# Altium schematic sheet [07] - OTHER.SchDoc
size A3; DocumentNumber: 8; SheetNumber: 7; SheetTotal: 10
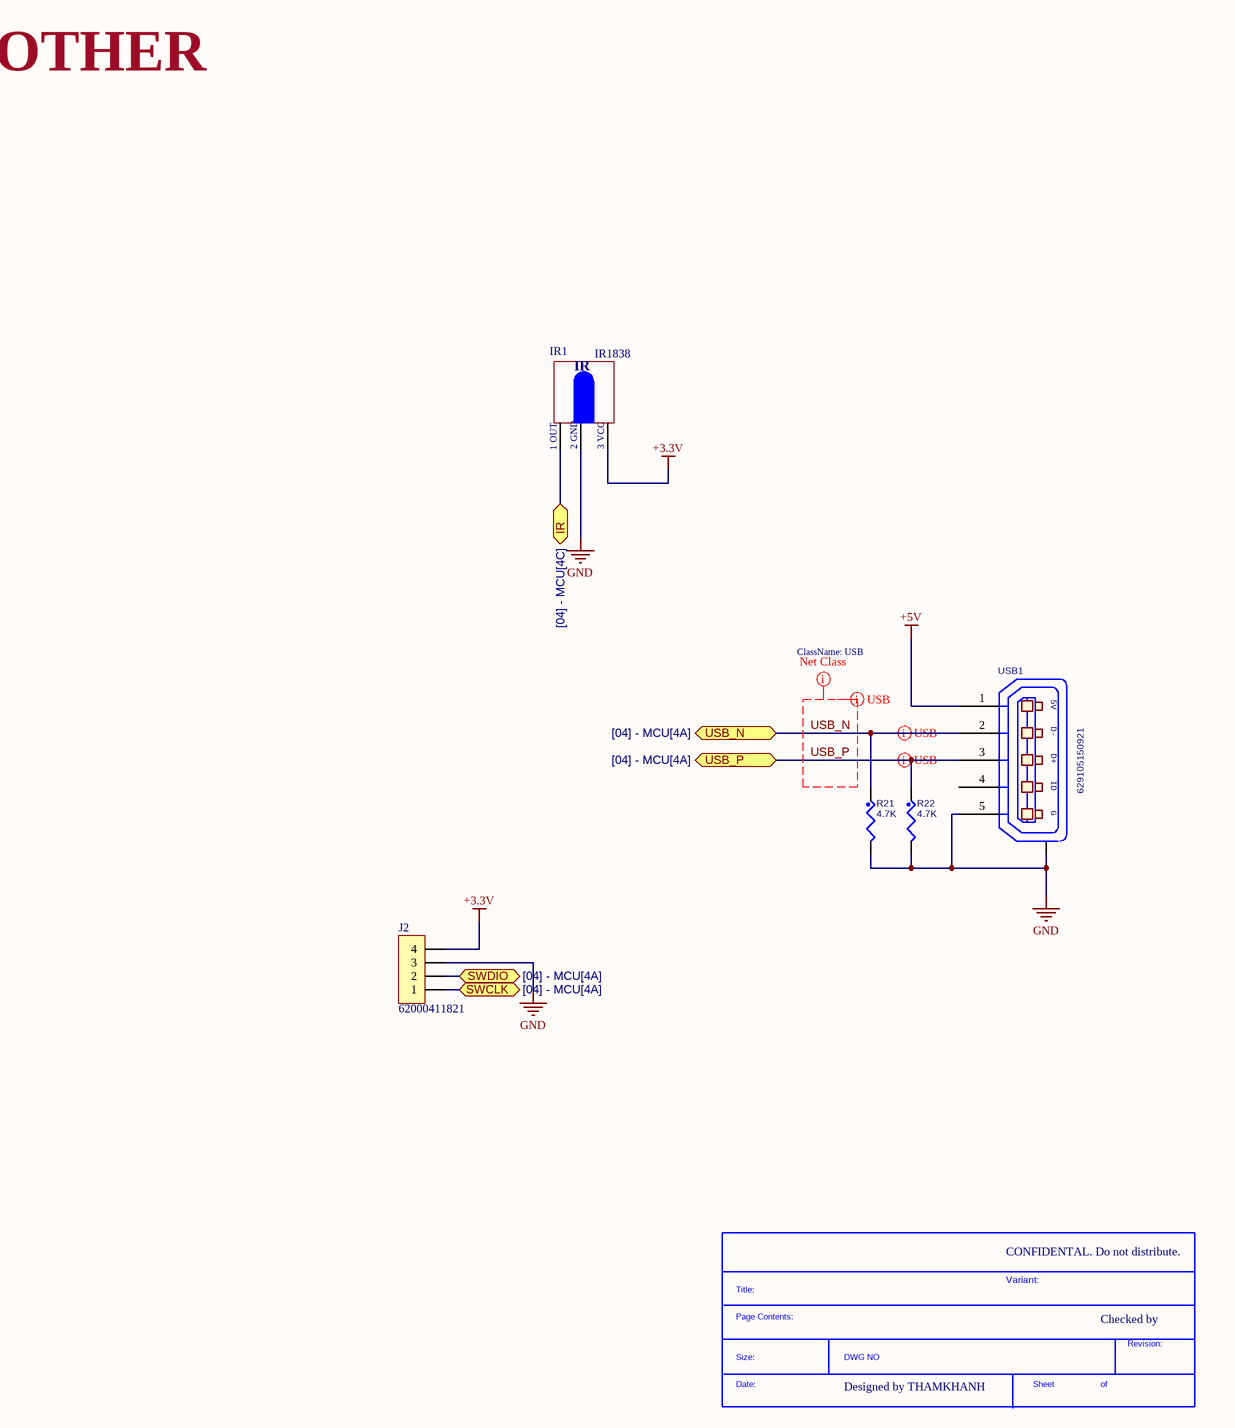
[diagram p0: [07] - OTHER.SchDoc]

## Parts
*?  SDTitleBlock  (value not drawn)  (graphical)
IR1  IR1838  [IR RECEIVE V1]
J2  62000411821  [62000411121]
R21  4.7K  [R0603]
R22  4.7K  [R0603]
USB1  629105150921  [USB-629105150921]

## Ports
IR (bidir, see [04] - MCU[4C]), SWCLK (bidir, see [04] - MCU[4A]), SWDIO (bidir, see [04] - MCU[4A]), USB_N (bidir, see [04] - MCU[4A]), USB_P (bidir, see [04] - MCU[4A])

## Nets
+3.3V: IR1.3(VCC) J2.4
+5V: USB1.1(P1)
GND: IR1.2(GND) J2.3 R21.2 R22.2 USB1.0(GND) USB1.5(P5)
IR: IR1.1(Out) ; port IR
SWCLK: J2.1 ; port SWCLK
SWDIO: J2.2 ; port SWDIO
USB_N: R21.1 USB1.2(P2) ; port USB_N
USB_P: R22.1 USB1.3(P3) ; port USB_P

Not connected (* = marked no-connect by the designer): USB1 4(P4)

## Layout directives
differential pair: USB_N, USB_P
net class USB: USB_N, USB_P

## Notes on the sheet
- OTHER
- CONFIDENTAL. Do not distribute.
- Variant:
- Checked by
- Designed by THAMKHANH
- (in symbol IR1838) IR; 1 OUT; 2 GND; 3 VCC
- (in symbol SDTitleBlock) Title:; Page Contents:; Revision:; Size:; DWG NO; Date:; Sheet; of
- (in symbol USB 2.0 Micro Type AB Female) 5V; D-; D+; ID; G

## Library data of the parts
IR1 = IR1838: VISHAY SEMICONDUCTOR   TSOP31238   IR RECEIVER, 40M, 38KHZ, SIP
J2 = JP4 2.00MM Single Socket: WR-PHD 2.00 mm Socket Header; Manufacturer: W¨¹rth Elektronik eiSos GmbH; ComponentLink1 Description: Manufacturer; ComponentLink2 Description: Datasheet; NoPins: 04; Created Date: 2 April 2013; partNo: 62000411821; ComponentLink1URL: http://www.we-online.com; ComponentLink2URL: http://katalog.we-online.de/em/datasheet/6200xx11821.pdf; Created by: Karrer Zheng
R21 R22 = RES-SMD: RES 0R OHM 1/8W 1% SMD; Manufacturer: Yageo; Manufacturer Part Number: RC0402FR-0749R9L; Power (Watts): 0.063W, 1/16W; .Checked PCB: used; Temperature Coefficient: ±100ppm/°C; Resistance: 3.3kR; Power Rating: 125mW; Voltage Rating: 100V; Category: Resistors; Supplier Part Number: 311-49.9LRCT-ND; Package / Case: 0402 (1005 Metric); Price 1k [$]: 0.01421; Tolerance: ±1%; Value: 0R; .Checked SCH: used; Supplier: Digikey; RoHS: RoHS Compliant; Composition: Thick Film; Features: -; Size / Dimension: 0.039" L x 0.020" W (1.00mm x 0.50mm); Height: 0.016" (0.40mm); Number of Terminations: 2; Packaging: Cut Tape (CT); ComponentLink1URL: http://www.yageo.com/documents/recent/PYu-RC0402_51_RoHS_L_6.pdf; ComponentLink1Description: http://www.yageo.com/documents/recent/PYu-RC0402_51_RoHS_L_6.pdf; Resistance (Ohms): 0R; Mount: Surface Mount; Case/Package: 0805; Number of Pins: 2; Contact Plating: Tin; Case Code (Metric): 2012; Case Code (Imperial): 0805; Min Operating Temperature: -55°C; Max Operating Temperature: 155°C; Package Quantity: 1; Termination: SMD/SMT; Military Standard: Not; Max Power Dissipation: 125mW; Voltage Rating (DC): 100V; Length: 2mm; Width: 1.25mm; Depth: 1.25mm; Radiation Hardening: No; REACH SVHC: No SVHC; Lead Free: Lead Free; ComponentLink2URL: http://www.farnell.com/datasheets/485442.pdf?src-supplier=Farnell; ComponentLink2Description: http://www.farnell.com/datasheets/485442.pdf?src-supplier=Farnell; ComponentLink3URL: http://uk.rs-online.com/webdocs/0bee/0900766b80beefcc.pdf?src-supplier=RSComponents; ComponentLink3Description: http://uk.rs-online.com/webdocs/0bee/0900766b80beefcc.pdf?src-supplier=RSComponents; ComponentLink4URL: http://industrial.panasonic.com/www-data/pdf/AOA0000/AOA0000CE26.pdf?src-supplier=Future+Electronics; ComponentLink4Description: http://industrial.panasonic.com/www-data/pdf/AOA0000/AOA0000CE26.pdf?src-supplier=Future+Electronics; ComponentLink5URL: https://www.alliedelec.com/m/d/b6b0537e86f421aa7f5975bb1d8f429a.pdf?src-supplier=Allied+Electronics; ComponentLink5Description: https://www.alliedelec.com/m/d/b6b0537e86f421aa7f5975bb1d8f429a.pdf?src-supplier=Allied+Electronics; ComponentLink6URL: http://industrial.panasonic.com/www-data/pdf/AOA0000/AOA0000CE26.pdf?src-supplier=Avnet; ComponentLink6Description: http://industrial.panasonic.com/www-data/pdf/AOA0000/AOA0000CE26.pdf?src-supplier=Avnet; ComponentLink7URL: http://industrial.panasonic.com/www-data/pdf/AOA0000/AOA0000CE26.pdf?src-supplier=Avnet+Europe; ComponentLink7Description: http://industrial.panasonic.com/www-data/pdf/AOA0000/AOA0000CE26.pdf?src-supplier=Avnet+Europe; ComponentLink8URL: http://industrial.panasonic.com/cdbs/www-data/pdf/RDM0000/AOA0000C307.pdf?src-supplier=Farnell; ComponentLink8Description: http://industrial.panasonic.com/cdbs/www-data/pdf/RDM0000/AOA0000C307.pdf?src-supplier=Farnell; ComponentLink9URL: https://www.distrelec.biz/Web/Downloads/_t/ds/ERA_eng_tds.pdf?mime=application%2Fpdf&src-supplier=Distrelec; ComponentLink9Description: https://www.distrelec.biz/Web/Downloads/_t/ds/ERA_eng_tds.pdf?mime=application%2Fpdf&src-supplier=Distrelec; ComponentLink10URL: http://www.farnell.com/datasheets/485442.pdf?src-supplier=Element14; ComponentLink10Description: http://www.farnell.com/datasheets/485442.pdf?src-supplier=Element14; ComponentLink11URL: http://www.farnell.com/datasheets/2052875.pdf?src-supplier=Farnell; ComponentLink11Description: http://www.farnell.com/datasheets/2052875.pdf?src-supplier=Farnell; ComponentLink12URL: http://www.farnell.com/datasheets/2059650.pdf?src-supplier=Farnell; ComponentLink12Description: http://www.farnell.com/datasheets/2059650.pdf?src-supplier=Farnell; ComponentLink13URL: https://produktinfo.conrad.com/datenblaetter/450000-474999/453184-da-01-en-WIDERSTAND_0805_ERA.pdf?src-supplier=Conrad; ComponentLink13Description: https://produktinfo.conrad.com/datenblaetter/450000-474999/453184-da-01-en-WIDERSTAND_0805_ERA.pdf?src-supplier=Conrad
USB1 = USB 2.0 Micro Type AB Female: Micro USB 2.0 Type AB; PartVertical: 614105150621; Interface Type: Type AB; Gender: Receptacle; ComponentLink1Description: Manufacturer; ComponentLink1URL: http://www.we-online.de; ComponentLink2Description: Datasheet; ComponentLink2URL: http://katalog.we-online.de/em/datasheet/629105150921.pdf; PartHorizontal: 629105150921; Published Date: April 2017; Publisher: Wurth Elektronik; Sub-Family: Micro USB 2.0; Type: Horizontal; Construction: SMT